# Altium schematic sheet HEADERS_JMEDIA_JMISC.SchDoc: JMEDIA JMISC
size A3; Author: Silvio Navaretti; CompanyName: ARDUINO; DrawnBy: Silvio Navaretti; Engineer: Silvio Navaretti; Organization: ARDUINO; SheetNumber: 21; SheetTotal: 51; RevAuthor: Silvio Navaretti
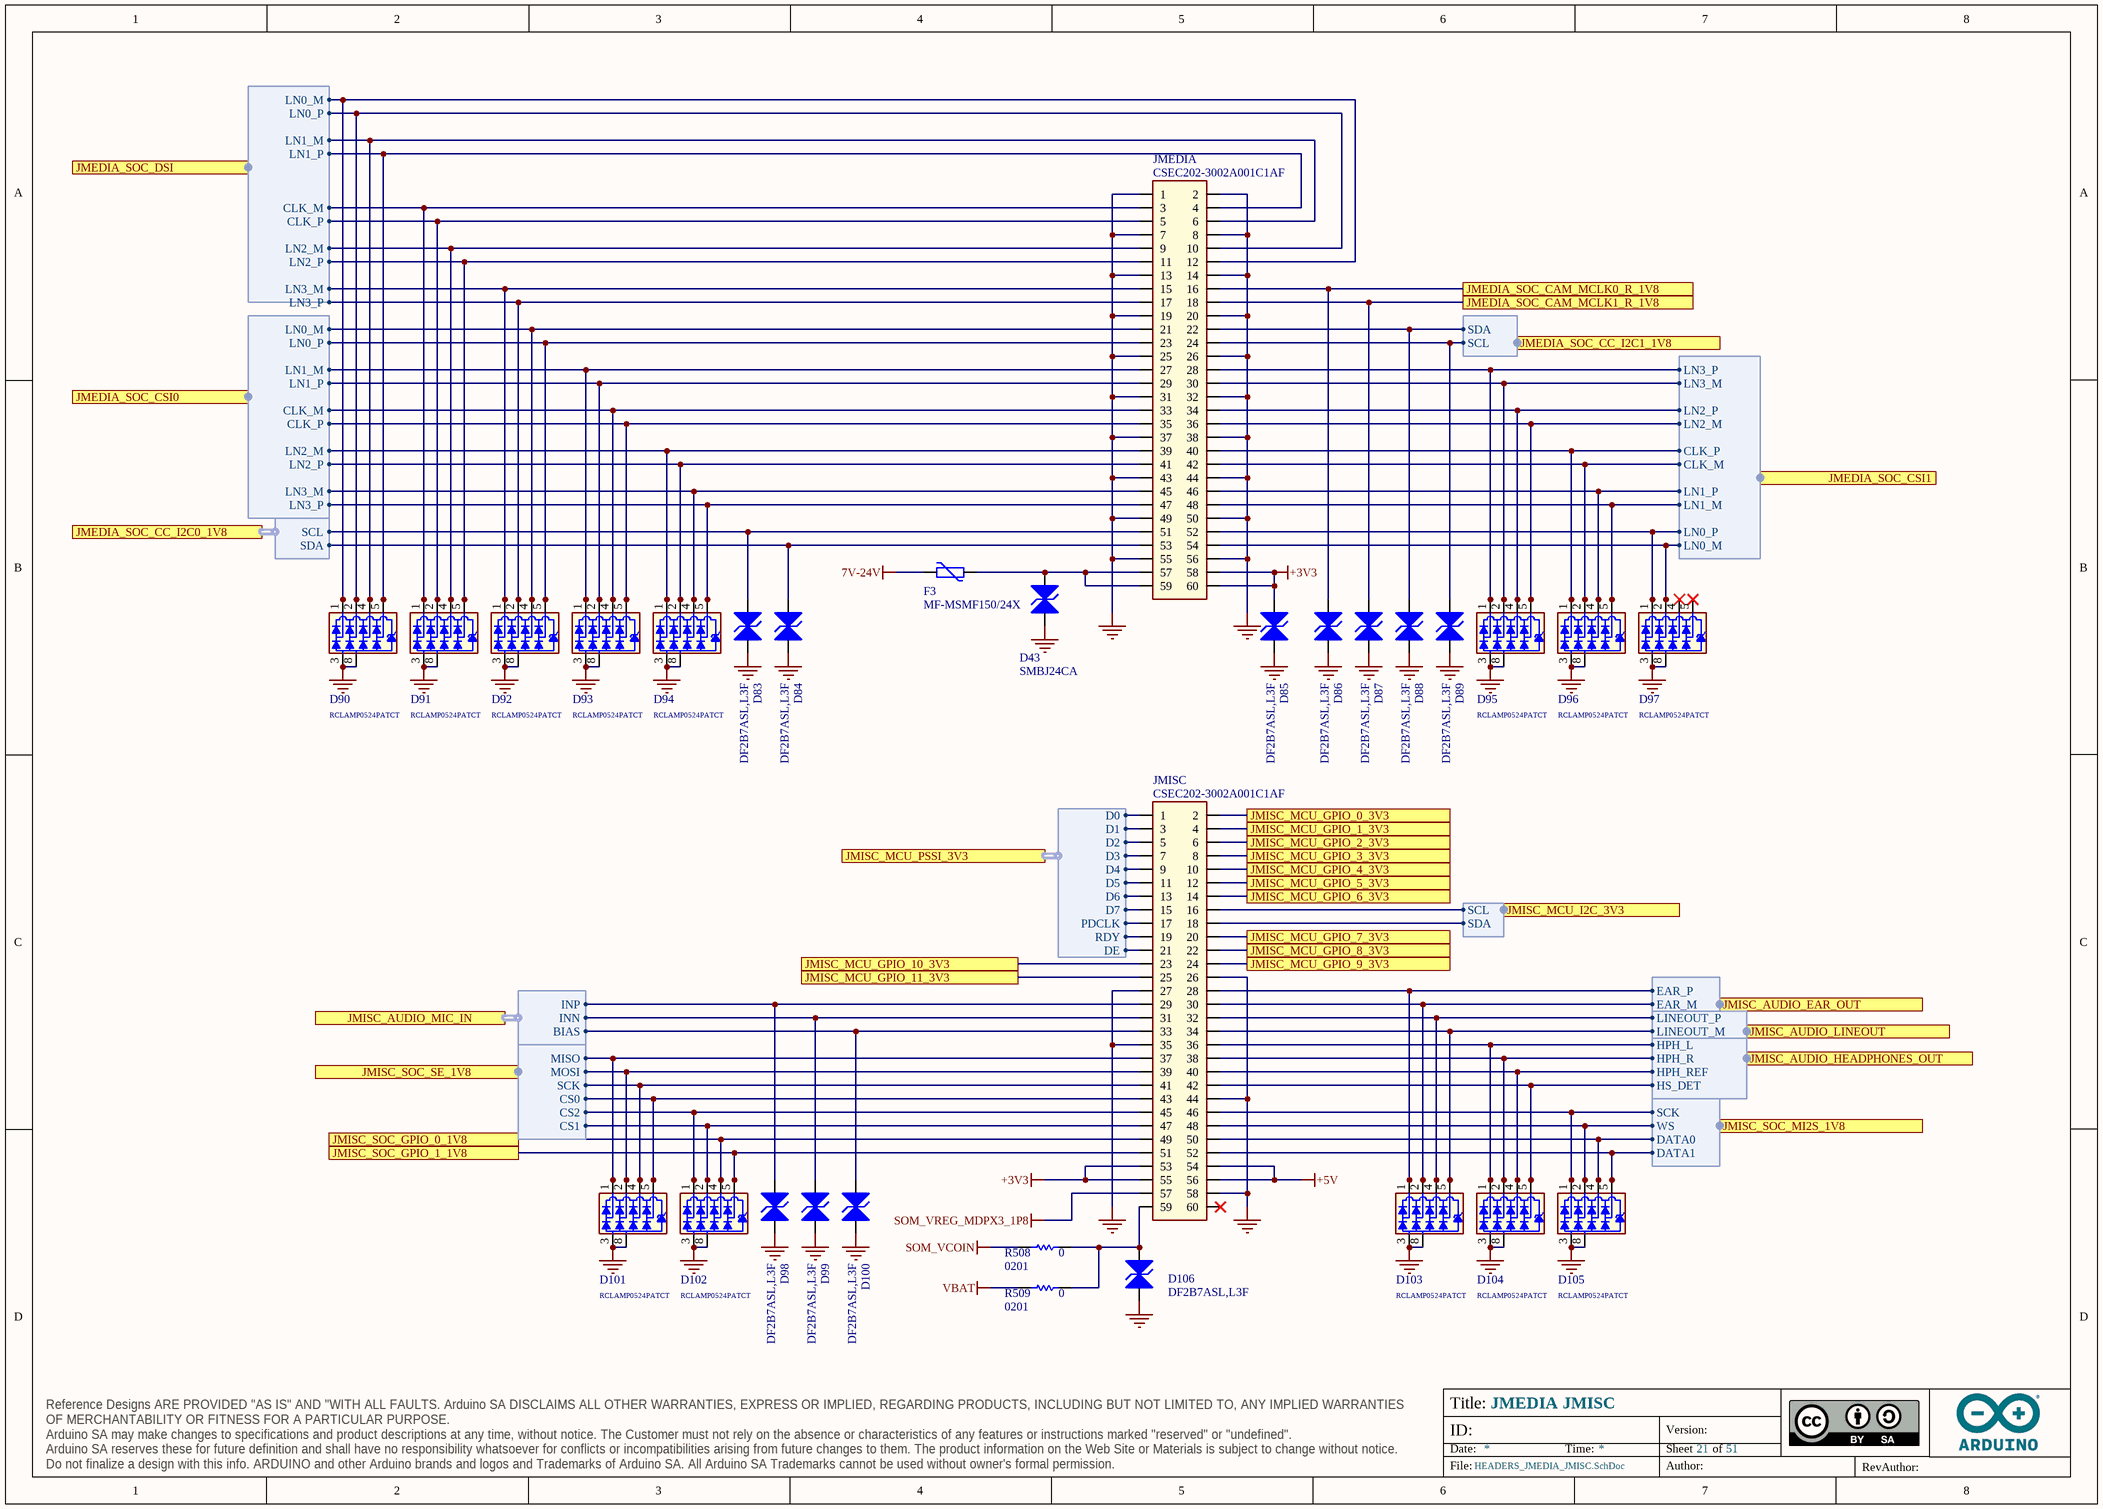
[diagram p0: HEADERS_JMEDIA_JMISC.SchDoc]

## Parts
D43  SMBJ24CA  [SMB_NOPOLARITY]
D83  DF2B7ASL,L3F  [DF2B7ASL,L3F]
D84  DF2B7ASL,L3F  [DF2B7ASL,L3F]
D85  DF2B7ASL,L3F  [DF2B7ASL,L3F]
D86  DF2B7ASL,L3F  [DF2B7ASL,L3F]
D87  DF2B7ASL,L3F  [DF2B7ASL,L3F]
D88  DF2B7ASL,L3F  [DF2B7ASL,L3F]
D89  DF2B7ASL,L3F  [DF2B7ASL,L3F]
D90  RCLAMP0524PATCT  [SLP2510P8]
D91  RCLAMP0524PATCT  [SLP2510P8]
D92  RCLAMP0524PATCT  [SLP2510P8]
D93  RCLAMP0524PATCT  [SLP2510P8]
D94  RCLAMP0524PATCT  [SLP2510P8]
D95  RCLAMP0524PATCT  [SLP2510P8]
D96  RCLAMP0524PATCT  [SLP2510P8]
D97  RCLAMP0524PATCT  [SLP2510P8]
D98  DF2B7ASL,L3F  [DF2B7ASL,L3F]
D99  DF2B7ASL,L3F  [DF2B7ASL,L3F]
D100  DF2B7ASL,L3F  [DF2B7ASL,L3F]
D101  RCLAMP0524PATCT  [SLP2510P8]
D102  RCLAMP0524PATCT  [SLP2510P8]
D103  RCLAMP0524PATCT  [SLP2510P8]
D104  RCLAMP0524PATCT  [SLP2510P8]
D105  RCLAMP0524PATCT  [SLP2510P8]
D106  DF2B7ASL,L3F  [DF2B7ASL,L3F]
F3  MF-MSMF150/24X  [1812]
JMEDIA  CSEC202-3002A001C1AF  [CSEC202-3002A001C1AF]
JMISC  CSEC202-3002A001C1AF  [CSEC202-3002A001C1AF]
R508  value 0  Case Code (Imperial): 0201  [RES-0201]  (hidden comment: CRCW02010000Z0ED)
R509  value 0  Case Code (Imperial): 0201  [RES-0201]  (hidden comment: CRCW02010000Z0ED)

## Ports
JMEDIA_SOC_CAM_MCLK0_R_1V8, JMEDIA_SOC_CAM_MCLK1_R_1V8, JMEDIA_SOC_CC_I2C0_1V8 (harness I2C), JMEDIA_SOC_CC_I2C1_1V8 (harness I2C), JMEDIA_SOC_CSI0 (harness MIPI_4LANES), JMEDIA_SOC_CSI1 (harness MIPI_4LANES), JMEDIA_SOC_DSI (harness MIPI_4LANES), JMISC_AUDIO_EAR_OUT (harness EAT), JMISC_AUDIO_HEADPHONES_OUT (harness HEADPHONES), JMISC_AUDIO_LINEOUT (harness LINEOUT), JMISC_AUDIO_MIC_IN (harness MIC), JMISC_MCU_GPIO_0_3V3, JMISC_MCU_GPIO_1_3V3, JMISC_MCU_GPIO_2_3V3, JMISC_MCU_GPIO_3_3V3, JMISC_MCU_GPIO_4_3V3, JMISC_MCU_GPIO_5_3V3, JMISC_MCU_GPIO_6_3V3, JMISC_MCU_GPIO_7_3V3, JMISC_MCU_GPIO_8_3V3, JMISC_MCU_GPIO_9_3V3, JMISC_MCU_GPIO_10_3V3, JMISC_MCU_GPIO_11_3V3, JMISC_MCU_I2C_3V3 (harness I2C), JMISC_MCU_PSSI_3V3 (harness PSSI), JMISC_SOC_GPIO_0_1V8, JMISC_SOC_GPIO_1_1V8, JMISC_SOC_MI2S_1V8 (harness SOM_MD_I2S), JMISC_SOC_SE_1V8 (harness SOM_MD_SPI_3CS)

## Harnesses
MIPI_4LANES: LN3_M, LN2_M, LN2_P, LN0_M, LN0_P, CLK_M, CLK_P, LN1_M, LN1_P, LN3_P
I2C: SDA, SCL
EAT: EAR_P, EAR_M
MIC: INP, INN, BIAS
LINEOUT: LINEOUT_P, LINEOUT_M
HEADPHONES: HPH_L, HPH_R, HPH_REF, HS_DET
SOM_MD_SPI_3CS: SCK, MISO, MOSI, CS0, CS1, CS2
SOM_MD_I2S: SCK, WS, DATA0, DATA1
PSSI: D0, D1, D2, D3, D4, D5, D6, D7, PDCLK, RDY, DE

## Nets
7V-24V: F3.1
+3V3: D85.2(A2) JMEDIA.58 JMEDIA.60 JMISC.53 JMISC.55
+5V: JMISC.54 JMISC.56
GND: D43.1(A1) D83.1(A1) D84.1(A1) D85.1(A1) D86.1(A1) D87.1(A1) D88.1(A1) D89.1(A1) D90.3 D90.8 D91.3 D91.8 D92.3 D92.8 D93.3 D93.8 D94.3 D94.8 D95.3 D95.8 D96.3 D96.8 D97.3 D97.8 D98.1(A1) D99.1(A1) D100.1(A1) D101.3 D101.8 D102.3 D102.8 D103.3 D103.8 D104.3 D104.8 D105.3 D105.8 D106.1(A1) JMEDIA.1 JMEDIA.2 JMEDIA.7 JMEDIA.8 JMEDIA.13 JMEDIA.14 JMEDIA.19 JMEDIA.20 JMEDIA.25 JMEDIA.26 JMEDIA.31 JMEDIA.32 JMEDIA.37 JMEDIA.38 JMEDIA.43 JMEDIA.44 JMEDIA.49 JMEDIA.50 JMEDIA.55 JMEDIA.56 JMISC.26 JMISC.27 JMISC.35 JMISC.44 JMISC.58
SOM_VCOIN: R508.2
SOM_VREG_MDPX3_1P8: JMISC.57
VBAT: R509.2
JMEDIA_SOC_CAM_MCLK0_R_1V8: D86.2(A2) JMEDIA.16 ; port JMEDIA_SOC_CAM_MCLK0_R_1V8
JMEDIA_SOC_CAM_MCLK1_R_1V8: D87.2(A2) JMEDIA.18 ; port JMEDIA_SOC_CAM_MCLK1_R_1V8
JMISC_MCU_GPIO_0_3V3: JMISC.2 ; port JMISC_MCU_GPIO_0_3V3
JMISC_MCU_GPIO_1_3V3: JMISC.4 ; port JMISC_MCU_GPIO_1_3V3
JMISC_MCU_GPIO_2_3V3: JMISC.6 ; port JMISC_MCU_GPIO_2_3V3
JMISC_MCU_GPIO_3_3V3: JMISC.8 ; port JMISC_MCU_GPIO_3_3V3
JMISC_MCU_GPIO_4_3V3: JMISC.10 ; port JMISC_MCU_GPIO_4_3V3
JMISC_MCU_GPIO_5_3V3: JMISC.12 ; port JMISC_MCU_GPIO_5_3V3
JMISC_MCU_GPIO_6_3V3: JMISC.14 ; port JMISC_MCU_GPIO_6_3V3
JMISC_MCU_GPIO_7_3V3: JMISC.20 ; port JMISC_MCU_GPIO_7_3V3
JMISC_MCU_GPIO_8_3V3: JMISC.22 ; port JMISC_MCU_GPIO_8_3V3
JMISC_MCU_GPIO_9_3V3: JMISC.24 ; port JMISC_MCU_GPIO_9_3V3
JMISC_MCU_GPIO_10_3V3: JMISC.23 ; port JMISC_MCU_GPIO_10_3V3
JMISC_MCU_GPIO_11_3V3: JMISC.25 ; port JMISC_MCU_GPIO_11_3V3
JMISC_SOC_GPIO_0_1V8: D102.4 D102.7 JMISC.49 ; port JMISC_SOC_GPIO_0_1V8
JMISC_SOC_GPIO_1_1V8: D102.5 D102.6 JMISC.51 ; port JMISC_SOC_GPIO_1_1V8
NetD43_2: D43.2(A2) F3.2 JMEDIA.57 JMEDIA.59
NetD83_2: D83.2(A2) JMEDIA.51 ; port JMEDIA_SOC_CC_I2C0_1V8.SCL
NetD84_2: D84.2(A2) JMEDIA.53 ; port JMEDIA_SOC_CC_I2C0_1V8.SDA
NetD88_2: D88.2(A2) JMEDIA.22 ; port JMEDIA_SOC_CC_I2C1_1V8.SDA
NetD89_2: D89.2(A2) JMEDIA.24 ; port JMEDIA_SOC_CC_I2C1_1V8.SCL
NetD90_1: D90.1 D90.10 JMEDIA.12 ; port JMEDIA_SOC_DSI.LN0_M
NetD90_2: D90.2 D90.9 JMEDIA.10 ; port JMEDIA_SOC_DSI.LN0_P
NetD90_4: D90.4 D90.7 JMEDIA.6 ; port JMEDIA_SOC_DSI.LN1_M
NetD90_5: D90.5 D90.6 JMEDIA.4 ; port JMEDIA_SOC_DSI.LN1_P
NetD91_1: D91.1 D91.10 JMEDIA.3 ; port JMEDIA_SOC_DSI.CLK_M
NetD91_2: D91.2 D91.9 JMEDIA.5 ; port JMEDIA_SOC_DSI.CLK_P
NetD91_4: D91.4 D91.7 JMEDIA.9 ; port JMEDIA_SOC_DSI.LN2_M
NetD91_5: D91.5 D91.6 JMEDIA.11 ; port JMEDIA_SOC_DSI.LN2_P
NetD92_1: D92.1 D92.10 JMEDIA.15 ; port JMEDIA_SOC_DSI.LN3_M
NetD92_2: D92.2 D92.9 JMEDIA.17 ; port JMEDIA_SOC_DSI.LN3_P
NetD92_4: D92.4 D92.7 JMEDIA.21 ; port JMEDIA_SOC_CSI0.LN0_M
NetD92_5: D92.5 D92.6 JMEDIA.23 ; port JMEDIA_SOC_CSI0.LN0_P
NetD93_1: D93.1 D93.10 JMEDIA.27 ; port JMEDIA_SOC_CSI0.LN1_M
NetD93_2: D93.2 D93.9 JMEDIA.29 ; port JMEDIA_SOC_CSI0.LN1_P
NetD93_4: D93.4 D93.7 JMEDIA.33 ; port JMEDIA_SOC_CSI0.CLK_M
NetD93_5: D93.5 D93.6 JMEDIA.35 ; port JMEDIA_SOC_CSI0.CLK_P
NetD94_1: D94.1 D94.10 JMEDIA.39 ; port JMEDIA_SOC_CSI0.LN2_M
NetD94_2: D94.2 D94.9 JMEDIA.41 ; port JMEDIA_SOC_CSI0.LN2_P
NetD94_4: D94.4 D94.7 JMEDIA.45 ; port JMEDIA_SOC_CSI0.LN3_M
NetD94_5: D94.5 D94.6 JMEDIA.47 ; port JMEDIA_SOC_CSI0.LN3_P
NetD95_1: D95.1 D95.10 JMEDIA.28 ; port JMEDIA_SOC_CSI1.LN3_P
NetD95_2: D95.2 D95.9 JMEDIA.30 ; port JMEDIA_SOC_CSI1.LN3_M
NetD95_4: D95.4 D95.7 JMEDIA.34 ; port JMEDIA_SOC_CSI1.LN2_P
NetD95_5: D95.5 D95.6 JMEDIA.36 ; port JMEDIA_SOC_CSI1.LN2_M
NetD96_1: D96.1 D96.10 JMEDIA.40 ; port JMEDIA_SOC_CSI1.CLK_P
NetD96_2: D96.2 D96.9 JMEDIA.42 ; port JMEDIA_SOC_CSI1.CLK_M
NetD96_4: D96.4 D96.7 JMEDIA.46 ; port JMEDIA_SOC_CSI1.LN1_P
NetD96_5: D96.5 D96.6 JMEDIA.48 ; port JMEDIA_SOC_CSI1.LN1_M
NetD97_1: D97.1 D97.10 JMEDIA.52 ; port JMEDIA_SOC_CSI1.LN0_P
NetD97_2: D97.2 D97.9 JMEDIA.54 ; port JMEDIA_SOC_CSI1.LN0_M
NetD97_4: D97.4 D97.7
NetD97_5: D97.5 D97.6
NetD98_2: D98.2(A2) JMISC.29 ; port JMISC_AUDIO_MIC_IN.INP
NetD99_2: D99.2(A2) JMISC.31 ; port JMISC_AUDIO_MIC_IN.INN
NetD100_2: D100.2(A2) JMISC.33 ; port JMISC_AUDIO_MIC_IN.BIAS
NetD101_1: D101.1 D101.10 JMISC.37 ; port JMISC_SOC_SE_1V8.MISO
NetD101_2: D101.2 D101.9 JMISC.39 ; port JMISC_SOC_SE_1V8.MOSI
NetD101_4: D101.4 D101.7 JMISC.41 ; port JMISC_SOC_SE_1V8.SCK
NetD101_5: D101.5 D101.6 JMISC.43 ; port JMISC_SOC_SE_1V8.CS0
NetD102_1: D102.1 D102.10 JMISC.45 ; port JMISC_SOC_SE_1V8.CS2
NetD102_2: D102.2 D102.9 JMISC.47 ; port JMISC_SOC_SE_1V8.CS1
NetD103_1: D103.1 D103.10 JMISC.28 ; port JMISC_AUDIO_EAR_OUT.EAR_P
NetD103_2: D103.2 D103.9 JMISC.30 ; port JMISC_AUDIO_EAR_OUT.EAR_M
NetD103_4: D103.4 D103.7 JMISC.32 ; port JMISC_AUDIO_LINEOUT.LINEOUT_P
NetD103_5: D103.5 D103.6 JMISC.34 ; port JMISC_AUDIO_LINEOUT.LINEOUT_M
NetD104_1: D104.1 D104.10 JMISC.36 ; port JMISC_AUDIO_HEADPHONES_OUT.HPH_L
NetD104_2: D104.2 D104.9 JMISC.38 ; port JMISC_AUDIO_HEADPHONES_OUT.HPH_R
NetD104_4: D104.4 D104.7 JMISC.40 ; port JMISC_AUDIO_HEADPHONES_OUT.HPH_REF
NetD104_5: D104.5 D104.6 JMISC.42 ; port JMISC_AUDIO_HEADPHONES_OUT.HS_DET
NetD105_1: D105.1 D105.10 JMISC.46 ; port JMISC_SOC_MI2S_1V8.SCK
NetD105_2: D105.2 D105.9 JMISC.48 ; port JMISC_SOC_MI2S_1V8.WS
NetD105_4: D105.4 D105.7 JMISC.50 ; port JMISC_SOC_MI2S_1V8.DATA0
NetD105_5: D105.5 D105.6 JMISC.52 ; port JMISC_SOC_MI2S_1V8.DATA1
NetD106_2: D106.2(A2) JMISC.59 R508.1 R509.1
NetJMISC_1: JMISC.1 ; port JMISC_MCU_PSSI_3V3.D0
NetJMISC_3: JMISC.3 ; port JMISC_MCU_PSSI_3V3.D1
NetJMISC_5: JMISC.5 ; port JMISC_MCU_PSSI_3V3.D2
NetJMISC_7: JMISC.7 ; port JMISC_MCU_PSSI_3V3.D3
NetJMISC_9: JMISC.9 ; port JMISC_MCU_PSSI_3V3.D4
NetJMISC_11: JMISC.11 ; port JMISC_MCU_PSSI_3V3.D5
NetJMISC_13: JMISC.13 ; port JMISC_MCU_PSSI_3V3.D6
NetJMISC_15: JMISC.15 ; port JMISC_MCU_PSSI_3V3.D7
NetJMISC_16: JMISC.16 ; port JMISC_MCU_I2C_3V3.SCL
NetJMISC_17: JMISC.17 ; port JMISC_MCU_PSSI_3V3.PDCLK
NetJMISC_18: JMISC.18 ; port JMISC_MCU_I2C_3V3.SDA
NetJMISC_19: JMISC.19 ; port JMISC_MCU_PSSI_3V3.RDY
NetJMISC_21: JMISC.21 ; port JMISC_MCU_PSSI_3V3.DE

Not connected (* = marked no-connect by the designer): JMISC 60*

## Notes on the sheet
- Title:
- ID:
- Date:
- Time:
- Version:
- Sheet
- of
- RevAuthor:
- Reference Designs ARE PROVIDED "AS IS" AND "WITH ALL FAULTS. Arduino SA DISCLAIMS ALL OTHER WARRANTIES, EXPRESS OR IMPLIED, REGARDING PRODUCTS, INCLUDING BUT NOT LIMITED TO, ANY IMPLIED WARRANTIES OF MERCHANTABILITY OR FITNESS FOR A PARTICULAR PURPOSE.
  Arduino SA may make changes to specifications and product descriptions at any time, without notice. The Customer must not rely on the absence or characteristics of any features or instructions marked "reserved" or "undefined".
  Arduino SA reserves these for future definition and shall have no responsibility whatsoever for conflicts or incompatibilities arising from future changes to them. The product information on the Web Site or Materials is subject to change without notice.
  Do not finalize a design with this info. ARDUINO and other Arduino brands and logos and Trademarks of Arduino SA. All Arduino SA Trademarks cannot be used without owner's formal permission.
- File:
- Author:

## Library data of the parts
D43 = D0070-A.2: TVS BIDIRECTIONAL SMD Vr 24V, Vbr min 26.7V, 600W, SMB; Manufacturer: Littlefuse; V(BR) Typ (V): 26.7; Code Arduino: D0070; Manufacturer 2: Bourns; Part Number: SMBJ24CA; Manufacturer 3: Hottech
D83-D89 D98-D100 D106 = D0099-5: TVS BIDIRECTIONAL SMD Vr 5.5V, Vbr min 5.8V, 0.62x0.32mm; Manufacturer: TOSHIBA; Vforward max: 0V; Ireverse max: 1µA; Power max: 80W; Code Arduino: D0099; Vreverse max: 20V; V(BR) min: 5.8V; V(RWM) max: 5.5V; Part Number: DF2B7ASL,L3F
D90-D97 D101-D105 = D0097-A.6: TVS UNIDIRECTIONAL 4CH 0.8pF 5V SLP2510P8 10-pin 2.5x1.0x0.58mm; Manufacturer: SEMTECH; Code Arduino: D0097; Device Type: ESD protection; Part Number: RCLAMP0524PATCT
F3 = P0019-A.1: PTC Ihold 1.5A Itrip 3A 24V 1812; Manufacturer: Bourns; Code Arduino: P0019; Part Number: MF-MSMF150/24X
JMEDIA JMISC = J0565-A.3: CONN HEADER FEMALE VERTICAL SMD 1.27mm 2x30 POS heigth 4.4mm; Manufacturer: Greenconn; Code Arduino: J0565; Part Number: CSEC202-3002A001C1AF
R508 R509 = R0140-A.21: RES CHIP 0201 0R; Manufacturer: Vishay; Temperature coefficient: 0ppm; Code Arduino: R0140; Power: 50mW; Tolerance: 0%; Technology: Thick film; Part Number: CRCW02010000Z0ED